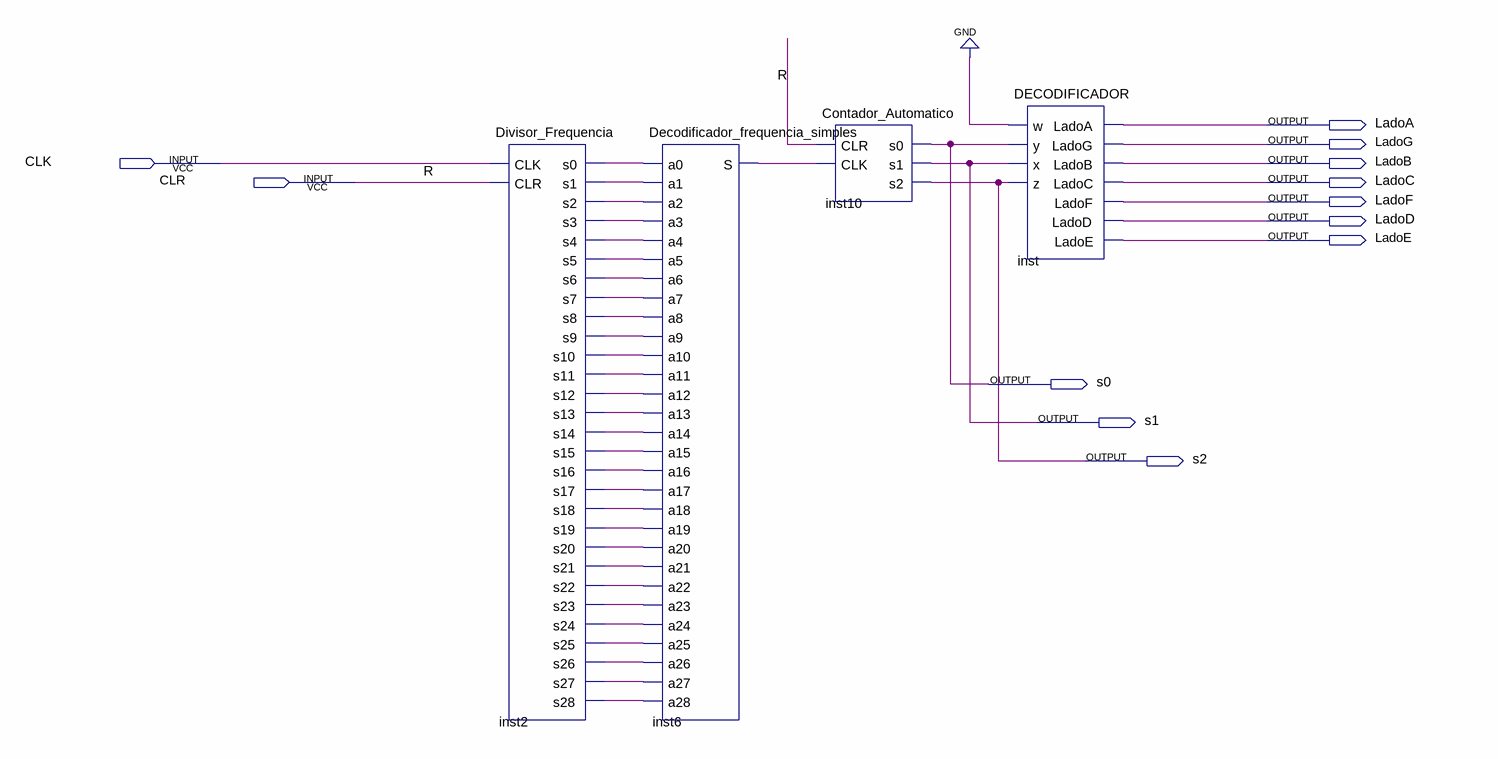
[diagram p0: schematic sheet]
// Quartus schematic Projeto3.bdf as structural Verilog: 4 symbols, 12 pins
module Projeto3 (
  input  CLK,
  input  CLR,
  output LadoA,
  output LadoG,
  output LadoB,
  output LadoC,
  output LadoF,
  output LadoD,
  output LadoE,
  output s0,
  output s1,
  output s2
);

  wire inst2_s0, inst2_s1, inst2_s2, inst2_s3, inst2_s4, inst2_s5, inst2_s6, inst2_s7, inst2_s8, inst2_s9,
       inst2_s10, inst2_s11, inst2_s12, inst2_s13, inst2_s14, inst2_s15, inst2_s16, inst2_s17, inst2_s18,
       inst2_s19, inst2_s20, inst2_s21, inst2_s22, inst2_s23, inst2_s24, inst2_s25, inst2_s26, inst2_s27,
       inst2_s28, inst6_s;

  Divisor_Frequencia inst2 (
    .CLK(CLK), .CLR(CLR), .s0(inst2_s0), .s1(inst2_s1), .s2(inst2_s2), .s3(inst2_s3), .s4(inst2_s4),
    .s5(inst2_s5), .s6(inst2_s6), .s7(inst2_s7), .s8(inst2_s8), .s9(inst2_s9), .s10(inst2_s10),
    .s11(inst2_s11), .s12(inst2_s12), .s13(inst2_s13), .s14(inst2_s14), .s15(inst2_s15), .s16(inst2_s16),
    .s17(inst2_s17), .s18(inst2_s18), .s19(inst2_s19), .s20(inst2_s20), .s21(inst2_s21), .s22(inst2_s22),
    .s23(inst2_s23), .s24(inst2_s24), .s25(inst2_s25), .s26(inst2_s26), .s27(inst2_s27), .s28(inst2_s28));
  Decodificador_frequencia_simples inst6 (
    .a0(inst2_s0), .a1(inst2_s1), .a2(inst2_s2), .a3(inst2_s3), .a4(inst2_s4), .a5(inst2_s5), .a6(inst2_s6),
    .a7(inst2_s7), .a8(inst2_s8), .a9(inst2_s9), .a10(inst2_s10), .a11(inst2_s11), .a12(inst2_s12),
    .a13(inst2_s13), .a14(inst2_s14), .a15(inst2_s15), .a16(inst2_s16), .a17(inst2_s17), .a18(inst2_s18),
    .a19(inst2_s19), .a20(inst2_s20), .a21(inst2_s21), .a22(inst2_s22), .a23(inst2_s23), .a24(inst2_s24),
    .a25(inst2_s25), .a26(inst2_s26), .a27(inst2_s27), .a28(inst2_s28), .S(inst6_s));
  Contador_Automatico inst10 (.CLR(CLR), .CLK(inst6_s), .s0(s0), .s1(s1), .s2(s2));
  DECODIFICADOR inst (
    .w(1'b0), .y(s0), .x(s1), .z(s2), .LadoA(LadoA), .LadoG(LadoG), .LadoB(LadoB), .LadoC(LadoC),
    .LadoF(LadoF), .LadoD(LadoD), .LadoE(LadoE));

  // Other names for the same wires on the sheet: R = CLR
endmodule
